# Altium schematic sheet Ethernet.SchDoc
size A4
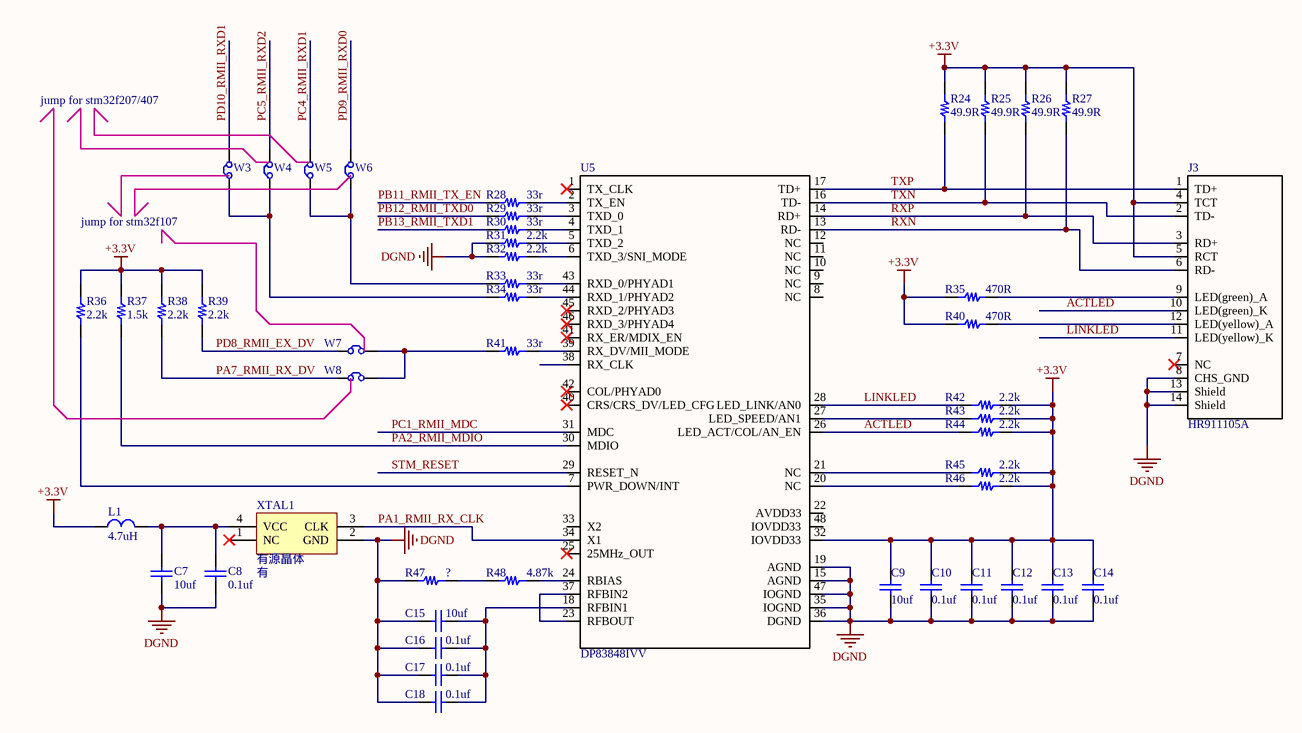
[diagram p0: Ethernet.SchDoc]

## Parts
C7  10uf  [0805C]
C8  0.1uf  [0805C]
C9  10uf  [0805C]
C10  0.1uf  [0805C]
C11  0.1uf  [0805C]
C12  0.1uf  [0805C]
C13  0.1uf  [0805C]
C14  0.1uf  [0805C]
C15  10uf  [0805C]
C16  0.1uf  [0805C]
C17  0.1uf  [0805C]
C18  0.1uf  [0805C]
J3  HR911105A  [RJ45-HR911105A]
L1  4.7uH  [0805_SmallR]
R24  49.9R  [0805_small]
R25  49.9R  [0805_small]
R26  49.9R  [0805_small]
R27  49.9R  [0805_small]
R28  33r  [0805_small]
R29  33r  [0805_small]
R30  33r  [0805_small]
R31  2.2k  [0805_small]
R32  2.2k  [0805_small]
R33  33r  [0805_small]
R34  33r  [0805_small]
R35  470R  [0805_small]
R36  2.2k  [0805_small]
R37  1.5k  [0805_small]
R38  2.2k  [0805_small]
R39  2.2k  [0805_small]
R40  470R  [0805_small]
R41  33r  [0805_small]
R42  2.2k  [0805_small]
R43  2.2k  [0805_small]
R44  2.2k  [0805_small]
R45  2.2k  [0805_small]
R46  2.2k  [0805_small]
R47  ?  [0805_small]
R48  4.87k  [0805_small]
U5  DP83848IVV  [LQFP-48]
W3  (no value)  [0603_jump_Pad]
W4  (no value)  [0603_jump_Pad]
W5  (no value)  [0603_jump_Pad]
W6  (no value)  [0603_jump_Pad]
W7  (no value)  [0603_jump_Pad]
W8  (no value)  [0603_jump_Pad]
XTAL1  有源晶体  [贴片有源晶体]

## Nets
+3.3V: C9.1 C10.1 C11.1 C12.1 C13.1 C14.1 J3.4(TCT) J3.5(RCT) L1.1 R24.1 R25.1 R26.1 R27.1 R35.1 R36.1 R37.1 R38.1 R39.1 R40.1 R42.2 R43.2 R44.2 R45.2 R46.2 U5.32(IOVDD33)
DGND: C7.2 C8.2 C9.2 C10.2 C11.2 C12.2 C13.2 C14.2 C15.2 C16.2 C17.2 C18.2 J3.8(CHS_GND) J3.13(Shield) J3.14(Shield) R31.2 R32.2 R47.2 U5.15(AGND) U5.19(AGND) U5.35(IOGND) U5.36(DGND) U5.47(IOGND) XTAL1.2(GND)
ACTLED: J3.10(LED(green)_K) R44.1 U5.26(LED_ACT/COL/AN_EN)
LINKLED: J3.11(LED(yellow)_K) R42.1 U5.28(LED_LINK/AN0)
PA1_RMII_RX_CLK: U5.34(X1) XTAL1.3(CLK)
PA2_RMII_MDIO: R37.2 U5.30(MDIO)
PA7_RMII_RX_DV: R38.2 W8.1(C1)
PB11_RMII_TX_EN: R28.2
PB12_RMII_TXD0: R29.2
PB13_RMII_TXD1: R30.2
PC1_RMII_MDC: U5.31(MDC)
PC4_RMII_RXD1: W5.2(C2)
PC5_RMII_RXD2: W4.2(C2)
PD8_RMII_EX_DV: R39.2 W7.1(C1)
PD9_RMII_RXD0: W6.2(C2)
PD10_RMII_RXD1: W3.2(C2)
RXN: J3.6(RD-) R27.2 U5.13(RD-)
RXP: J3.3(RD+) R26.2 U5.14(RD+)
STM_RESET: U5.29(RESET_N)
TXN: J3.2(TD-) R25.2 U5.16(TD-)
TXP: J3.1(TD+) R24.2 U5.17(TD+)
NetC7_1: C7.1 C8.1 L1.2 XTAL1.4(VCC)
NetC15_1: C15.1 C16.1 C17.1 C18.1 U5.18(RFBIN1)
NetJ3_9: J3.9(LED(green)_A) R35.2
NetJ3_12: J3.12(LED(yellow)_A) R40.2
NetR28_1: R28.1 U5.2(TX_EN)
NetR29_1: R29.1 U5.3(TXD_0)
NetR30_1: R30.1 U5.4(TXD_1)
NetR31_1: R31.1 U5.5(TXD_2)
NetR32_1: R32.1 U5.6(TXD_3/SNI_MODE)
NetR33_1: R33.1 U5.43(RXD_0/PHYAD1)
NetR33_2: R33.2 W5.1(C1) W6.1(C1)
NetR34_1: R34.1 U5.44(RXD_1/PHYAD2)
NetR34_2: R34.2 W3.1(C1) W4.1(C1)
NetR36_2: R36.2 U5.7(PWR_DOWN/INT)
NetR41_1: R41.1 U5.39(RX_DV/MII_MODE)
NetR41_2: R41.2 W7.2(C2) W8.2(C2)
NetR43_1: R43.1 U5.27(LED_SPEED/AN1)
NetR45_1: R45.1 U5.21(NC)
NetR46_1: R46.1 U5.20(NC)
NetR47_1: R47.1 R48.2
NetR48_1: R48.1 U5.24(RBIAS)
NetU5_23: U5.23(RFBOUT) U5.37(RFBIN2)

Not connected (* = marked no-connect by the designer): J3 7(NC)*; U5 1(TX_CLK)* 8(NC) 9(NC) 10(NC) 11(NC) 12(NC) 22(AVDD33) 25(25MHz_OUT)* 33(X2) 38(RX_CLK) 40(CRS/CRS_DV/LED_CFG)* 41(RX_ER/MDIX_EN)* 42(COL/PHYAD0)* 45(RXD_2/PHYAD3)* 46(RXD_3/PHYAD4)* 48(IOVDD33); XTAL1 1(NC)*

## Notes on the sheet
- jump for stm32f207/407
- jump for stm32f107
- (in symbol 有源晶体) 有

## Library data of the parts
C7-C18 = Cap: 贴片电容; Value: 100pF; Published: 8-Jun-2000; LatestRevisionDate: 17-Jul-2002; LatestRevisionNote: Re-released for DXP Platform.; PackageReference: RAD-0.3; Publisher: Altium Limited
J3 = HR911105A: 带网络变压器的网络接口
L1 = Inductor: 电感; Code_IEC: 1005; Published: 8-Jun-2000; LatestRevisionDate: 29-May-2009; LatestRevisionNote: IPC-7351 Footprint Added.; PackageReference: 0402-A; Publisher: Altium Limited; PackageDescription: Chip Inductor; Code_JEITA: 0402; Value: 4.7uH
R24-R48 = Res: 电阻; Value: 230k; Published: 24-Mar-1999; LatestRevisionDate: 29-May-2009; LatestRevisionNote: IPC-7351 Footprint Added.; PackageVersion: Mar-2003; PackageReference: 6-0805; Publisher: Altium Limited; PackageDescription: Chip Resistor 0805 Case Size; Code_IPC: RESC2012
U5 = DP83848IVV: DP83848 PHY
W3-W8 = Jumper: Jumper Wire; Published: 24-Mar-1999; LatestRevisionDate: 17-Jul-2002; LatestRevisionNote: Re-released for DXP Platform.; PackageReference: RAD-0.2; Publisher: Altium Limited; PackageDescription: Radial Cap, Thru-Hole; 2 Leads; 0.2 in Pin Spacing